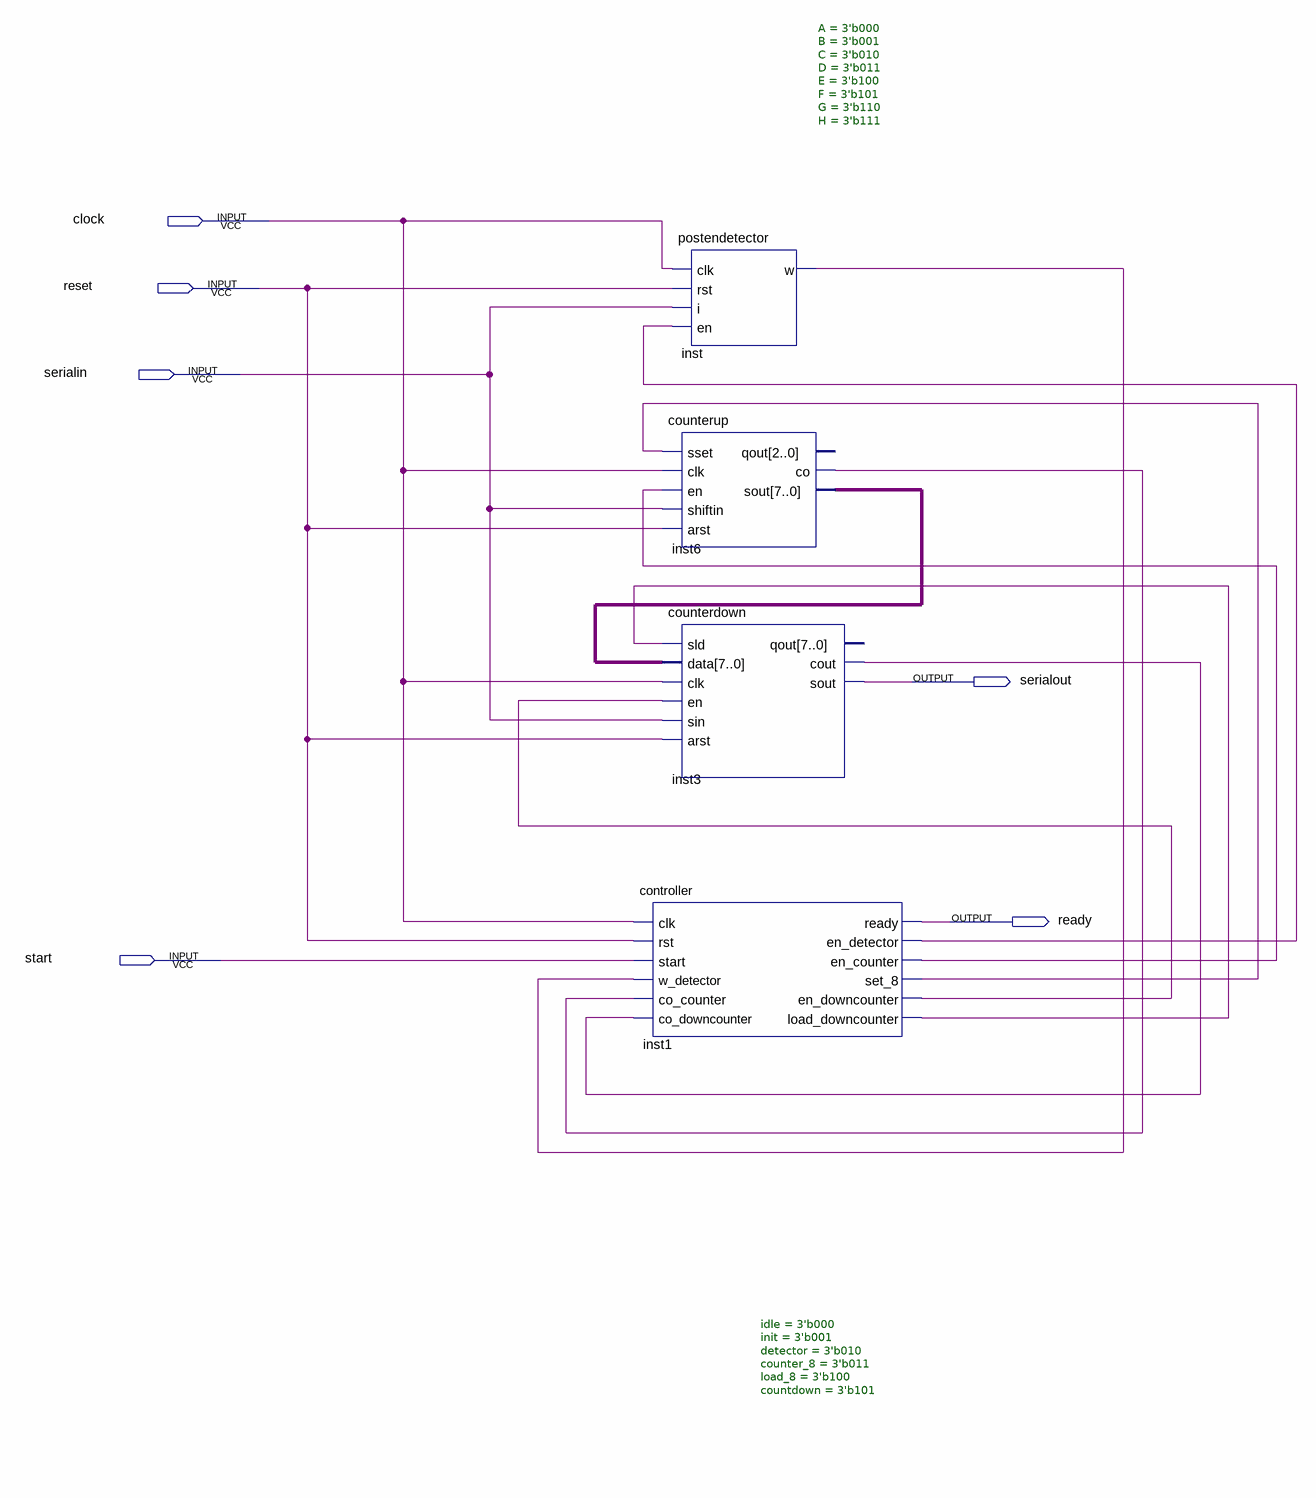
[diagram p0: schematic sheet]
// Quartus schematic finalcircuit.bdf as structural Verilog: 4 symbols, 6 pins
module finalcircuit (
  input  clock,
  input  reset,
  input  serialin,
  input  start,
  output serialout,
  output ready
);

  wire inst1_en_counter, inst1_en_detector, inst1_en_downcounter, inst1_load_downcounter, inst1_set_8,
       inst3_cout, inst6_co, inst_w;
  wire [7:0] inst6_sout;

  controller #(.idle(3'b000), .init(3'b001), .detector(3'b010), .counter_8(3'b011), .load_8(3'b100), .countdown(3'b101)) inst1 (
    .clk(clock), .rst(reset), .start(start), .w_detector(inst_w), .co_counter(inst6_co),
    .co_downcounter(inst3_cout), .ready(ready), .en_detector(inst1_en_detector),
    .en_counter(inst1_en_counter), .set_8(inst1_set_8), .en_downcounter(inst1_en_downcounter),
    .load_downcounter(inst1_load_downcounter));
  postendetector #(.A(3'b000), .B(3'b001), .C(3'b010), .D(3'b011), .E(3'b100), .F(3'b101), .G(3'b110), .H(3'b111)) inst (
    .clk(clock), .rst(reset), .i(serialin), .en(inst1_en_detector), .w(inst_w));
  counterup inst6 (
    .sset(inst1_set_8), .clk(clock), .en(inst1_en_counter), .shiftin(serialin), .arst(reset), .co(inst6_co),
    .sout(inst6_sout));  // open: qout
  counterdown inst3 (
    .sld(inst1_load_downcounter), .data(inst6_sout), .clk(clock), .en(inst1_en_downcounter), .sin(serialin),
    .arst(reset), .cout(inst3_cout), .sout(serialout));  // open: qout
endmodule
